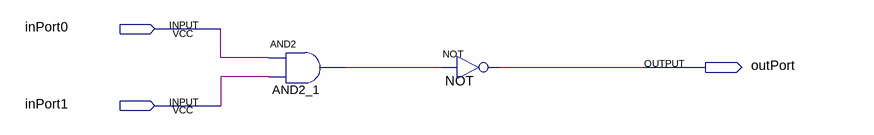
[diagram p0: schematic sheet]
// Quartus schematic GateDemo.bdf as structural Verilog: 2 symbols, 3 pins
module GateDemo (
  input  inPort0,
  input  inPort1,
  output outPort
);

  wire AND2_1_out;

  and AND2_1 (AND2_1_out, inPort0, inPort1);
  not NOT (outPort, AND2_1_out);
endmodule
